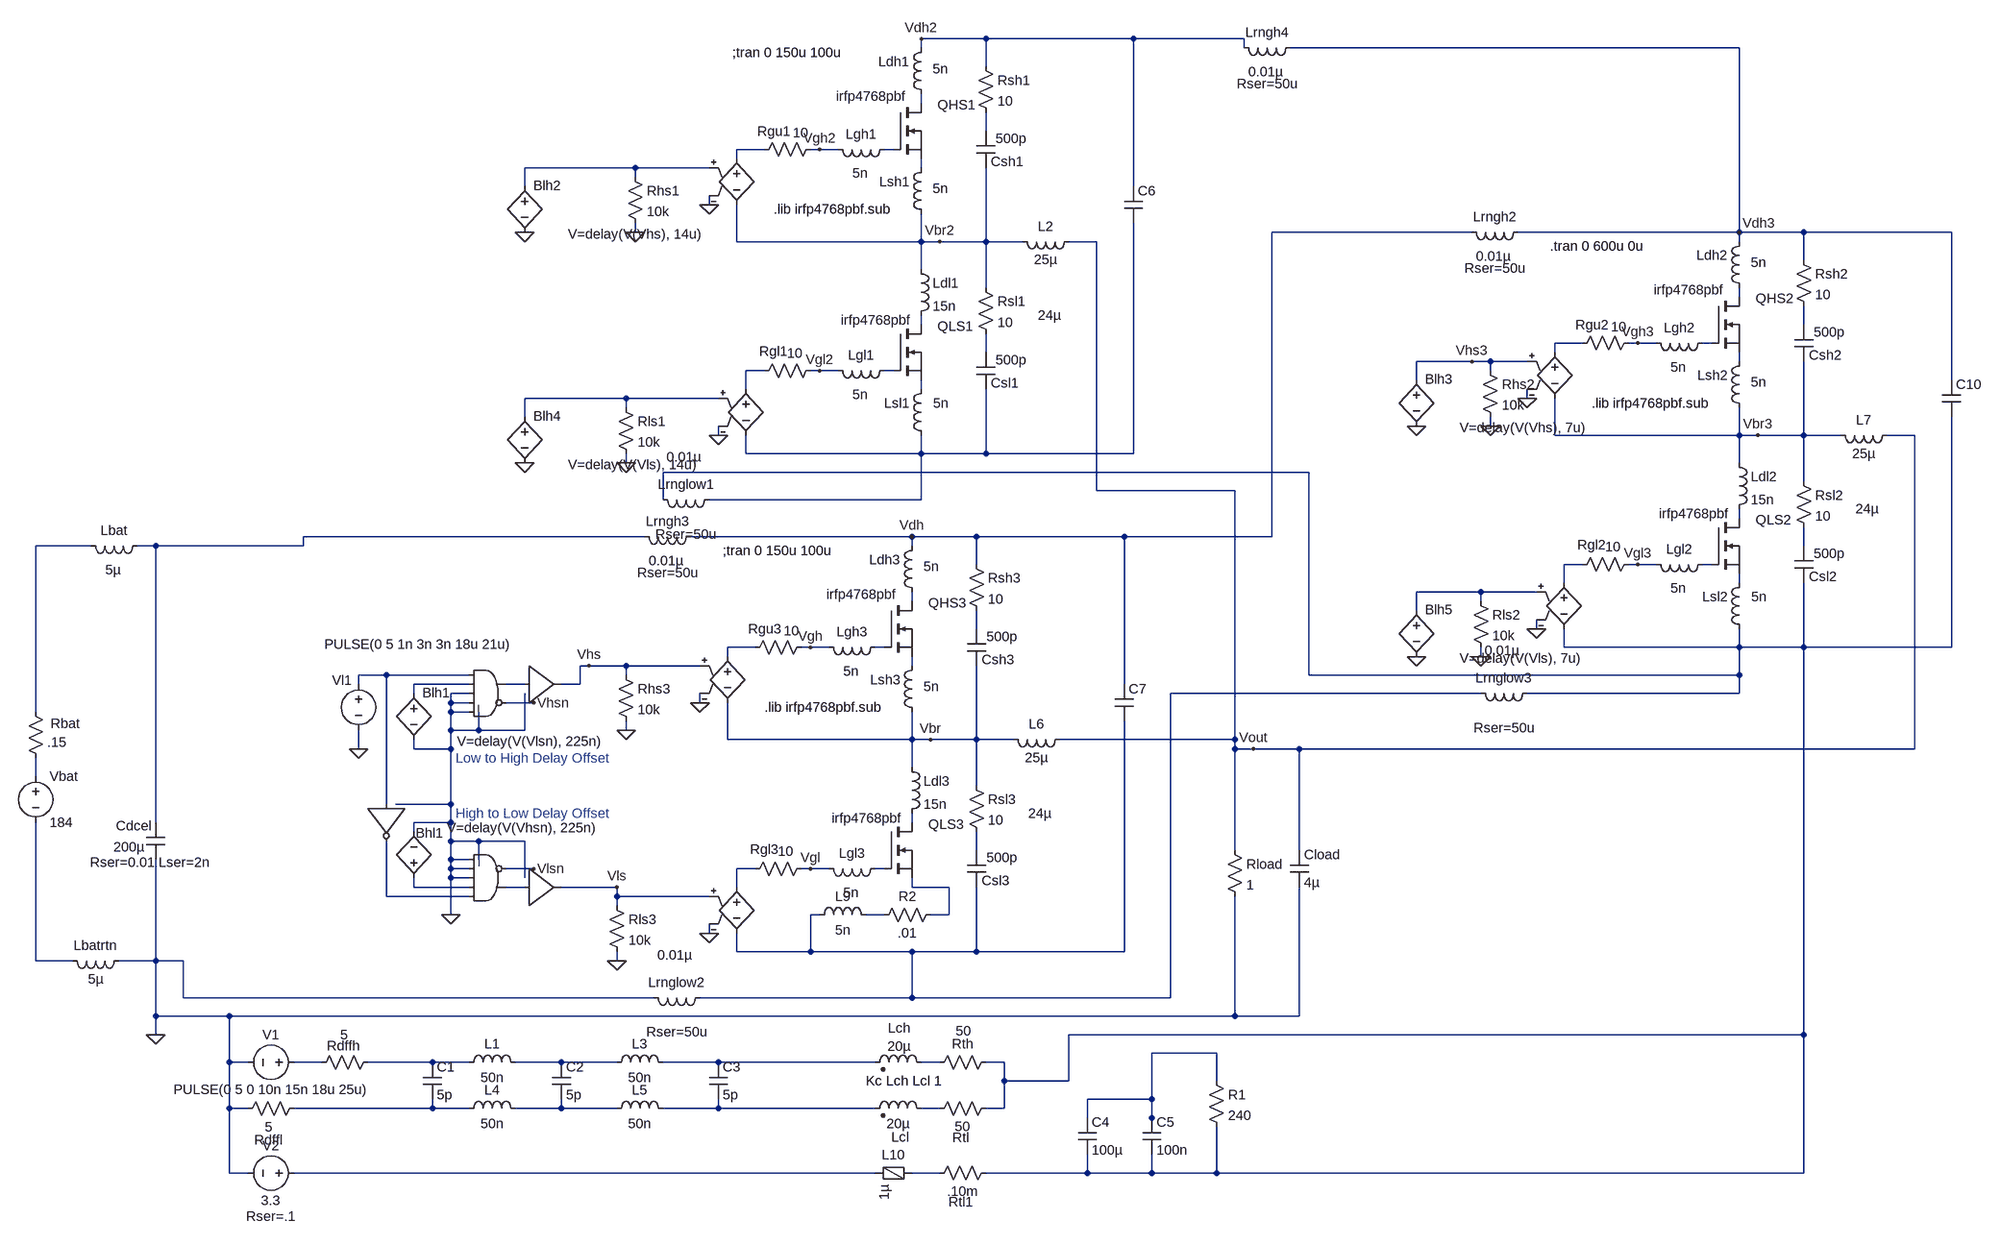
[diagram p0: schematic ETdcdc3P1.asc]
ETdcdc3P1.asc, the LTspice schematic file:
Version 4
SHEET 1 880 1164
WIRE -2224 -896 -2336 -896
WIRE -1968 -896 -2224 -896
WIRE -1776 -896 -1968 -896
WIRE -2336 -880 -2336 -896
WIRE -1776 -880 -1776 -896
WIRE -672 -880 -1696 -880
WIRE -2224 -848 -2224 -896
WIRE -2336 -784 -2336 -800
WIRE -2224 -736 -2224 -768
WIRE -2608 -704 -2656 -704
WIRE -2512 -704 -2528 -704
WIRE -2480 -704 -2512 -704
WIRE -2384 -704 -2400 -704
WIRE -2656 -688 -2656 -704
WIRE -2832 -672 -3024 -672
WIRE -2704 -672 -2832 -672
WIRE -2336 -672 -2336 -688
WIRE -2832 -656 -2832 -672
WIRE -3024 -640 -3024 -672
WIRE -1968 -640 -1968 -896
WIRE -2704 -608 -2704 -624
WIRE -2832 -560 -2832 -576
WIRE -1136 -560 -1728 -560
WIRE -672 -560 -672 -880
WIRE -672 -560 -1056 -560
WIRE -560 -560 -672 -560
WIRE -304 -560 -560 -560
WIRE -2656 -544 -2656 -608
WIRE -2336 -544 -2336 -592
WIRE -2336 -544 -2656 -544
WIRE -2304 -544 -2336 -544
WIRE -2224 -544 -2224 -672
WIRE -2224 -544 -2304 -544
WIRE -2160 -544 -2224 -544
WIRE -2032 -544 -2080 -544
WIRE -672 -544 -672 -560
WIRE -560 -512 -560 -560
WIRE -2336 -496 -2336 -544
WIRE -2224 -464 -2224 -544
WIRE -672 -448 -672 -464
WIRE -2336 -400 -2336 -416
WIRE -560 -400 -560 -432
WIRE -944 -368 -992 -368
WIRE -848 -368 -864 -368
WIRE -816 -368 -848 -368
WIRE -720 -368 -736 -368
WIRE -2224 -352 -2224 -384
WIRE -992 -352 -992 -368
WIRE -1136 -336 -1232 -336
WIRE -1104 -336 -1136 -336
WIRE -1040 -336 -1104 -336
WIRE -672 -336 -672 -352
WIRE -2608 -320 -2640 -320
WIRE -2512 -320 -2528 -320
WIRE -2480 -320 -2512 -320
WIRE -2384 -320 -2400 -320
WIRE -1104 -320 -1104 -336
WIRE -1232 -304 -1232 -336
WIRE -304 -304 -304 -560
WIRE -2640 -288 -2640 -320
WIRE -2336 -288 -2336 -304
WIRE -2848 -272 -3024 -272
WIRE -2688 -272 -2848 -272
WIRE -1040 -272 -1040 -288
WIRE -2848 -256 -2848 -272
WIRE -3024 -240 -3024 -272
WIRE -1104 -224 -1104 -240
WIRE -2688 -208 -2688 -224
WIRE -992 -208 -992 -272
WIRE -672 -208 -672 -256
WIRE -672 -208 -992 -208
WIRE -640 -208 -672 -208
WIRE -560 -208 -560 -336
WIRE -560 -208 -640 -208
WIRE -496 -208 -560 -208
WIRE -368 -208 -416 -208
WIRE -2640 -176 -2640 -208
WIRE -2336 -176 -2336 -208
WIRE -2336 -176 -2640 -176
WIRE -2224 -176 -2224 -288
WIRE -2224 -176 -2336 -176
WIRE -1968 -176 -1968 -576
WIRE -1968 -176 -2224 -176
WIRE -2848 -160 -2848 -176
WIRE -672 -160 -672 -208
WIRE -1664 -144 -2784 -144
WIRE -560 -128 -560 -208
WIRE -2032 -112 -2032 -544
WIRE -1792 -112 -2032 -112
WIRE -2784 -96 -2784 -144
WIRE -2336 -96 -2336 -176
WIRE -2336 -96 -2704 -96
WIRE -672 -64 -672 -80
WIRE -2816 -32 -3408 -32
WIRE -2352 -32 -2736 -32
WIRE -2240 -32 -2352 -32
WIRE -1984 -32 -2240 -32
WIRE -1728 -32 -1728 -560
WIRE -1728 -32 -1984 -32
WIRE -3776 -16 -3872 -16
WIRE -3664 -16 -3696 -16
WIRE -3408 -16 -3408 -32
WIRE -3408 -16 -3664 -16
WIRE -2352 -16 -2352 -32
WIRE -560 -16 -560 -48
WIRE -2240 16 -2240 -32
WIRE -944 16 -976 16
WIRE -848 16 -864 16
WIRE -816 16 -848 16
WIRE -720 16 -736 16
WIRE -976 48 -976 16
WIRE -672 48 -672 32
WIRE -1120 64 -1232 64
WIRE -1024 64 -1120 64
WIRE -2352 80 -2352 64
WIRE -1120 80 -1120 64
WIRE -1232 96 -1232 64
WIRE -2240 128 -2240 96
WIRE -1024 128 -1024 112
WIRE -2624 160 -2672 160
WIRE -2528 160 -2544 160
WIRE -2496 160 -2528 160
WIRE -2400 160 -2416 160
WIRE -976 160 -976 128
WIRE -672 160 -672 128
WIRE -672 160 -976 160
WIRE -560 160 -560 48
WIRE -560 160 -672 160
WIRE -304 160 -304 -240
WIRE -304 160 -560 160
WIRE -2672 176 -2672 160
WIRE -1120 176 -1120 160
WIRE -2912 192 -2928 192
WIRE -2848 192 -2912 192
WIRE -2720 192 -2848 192
WIRE -2352 192 -2352 176
WIRE -3264 208 -3312 208
WIRE -3120 208 -3264 208
WIRE -2848 208 -2848 192
WIRE -1664 208 -1664 -144
WIRE -672 208 -672 160
WIRE -672 208 -1664 208
WIRE -3312 224 -3312 208
WIRE -3120 224 -3216 224
WIRE -3024 224 -3056 224
WIRE -2928 224 -2928 192
WIRE -2928 224 -2960 224
WIRE -1984 224 -1984 -32
WIRE -3216 240 -3216 224
WIRE -3120 240 -3152 240
WIRE -1120 240 -1904 240
WIRE -672 240 -672 208
WIRE -672 240 -1040 240
WIRE -3152 256 -3152 240
WIRE -3120 256 -3152 256
WIRE -3008 256 -3056 256
WIRE -2720 256 -2720 240
WIRE -3872 272 -3872 -16
WIRE -3152 272 -3152 256
WIRE -3120 272 -3152 272
WIRE -3152 304 -3152 272
WIRE -3104 304 -3104 272
WIRE -3104 304 -3152 304
WIRE -3024 304 -3024 240
WIRE -3024 304 -3104 304
WIRE -2848 304 -2848 288
WIRE -2672 320 -2672 256
WIRE -2352 320 -2352 272
WIRE -2352 320 -2672 320
WIRE -2320 320 -2352 320
WIRE -2240 320 -2240 192
WIRE -2240 320 -2320 320
WIRE -2176 320 -2240 320
WIRE -1792 320 -1792 -112
WIRE -1792 320 -2096 320
WIRE -3312 336 -3312 304
WIRE -3216 336 -3216 320
WIRE -3152 336 -3152 304
WIRE -3152 336 -3216 336
WIRE -1792 336 -1792 320
WIRE -1760 336 -1792 336
WIRE -1680 336 -1760 336
WIRE -368 336 -368 -208
WIRE -368 336 -1680 336
WIRE -2352 368 -2352 320
WIRE -3872 384 -3872 352
WIRE -2240 400 -2240 320
WIRE -3264 432 -3264 208
WIRE -3152 432 -3152 336
WIRE -3152 432 -3248 432
WIRE -3664 464 -3664 -16
WIRE -3152 464 -3152 432
WIRE -3152 464 -3216 464
WIRE -2352 464 -2352 448
WIRE -3216 480 -3216 464
WIRE -3152 496 -3152 464
WIRE -3104 496 -3152 496
WIRE -3024 496 -3104 496
WIRE -2240 512 -2240 480
WIRE -1792 512 -1792 336
WIRE -1680 512 -1680 336
WIRE -3152 528 -3152 496
WIRE -3120 528 -3152 528
WIRE -3104 528 -3104 496
WIRE -3152 544 -3152 528
WIRE -3120 544 -3152 544
WIRE -3008 544 -3056 544
WIRE -2624 544 -2656 544
WIRE -2528 544 -2544 544
WIRE -2496 544 -2528 544
WIRE -2400 544 -2416 544
WIRE -3152 560 -3152 544
WIRE -3120 560 -3152 560
WIRE -3024 560 -3024 496
WIRE -3216 576 -3216 560
WIRE -3120 576 -3216 576
WIRE -3024 576 -3056 576
WIRE -2864 576 -2960 576
WIRE -2656 576 -2656 544
WIRE -2352 576 -2352 560
WIRE -2288 576 -2352 576
WIRE -3264 592 -3264 496
WIRE -3120 592 -3264 592
WIRE -2864 592 -2864 576
WIRE -2704 592 -2864 592
WIRE -2864 608 -2864 592
WIRE -3152 624 -3152 560
WIRE -2512 624 -2528 624
WIRE -2400 624 -2432 624
WIRE -2288 624 -2288 576
WIRE -2288 624 -2320 624
WIRE -2704 656 -2704 640
WIRE -2656 688 -2656 656
WIRE -2528 688 -2528 624
WIRE -2528 688 -2656 688
WIRE -2352 688 -2528 688
WIRE -2240 688 -2240 576
WIRE -2240 688 -2352 688
WIRE -1984 688 -1984 288
WIRE -1984 688 -2240 688
WIRE -3872 704 -3872 464
WIRE -3808 704 -3872 704
WIRE -3664 704 -3664 528
WIRE -3664 704 -3728 704
WIRE -3616 704 -3664 704
WIRE -2864 704 -2864 688
WIRE -3616 768 -3616 704
WIRE -2800 768 -3616 768
WIRE -2352 768 -2352 688
WIRE -2352 768 -2720 768
WIRE -1904 768 -1904 240
WIRE -1904 768 -2352 768
WIRE -3664 800 -3664 704
WIRE -3536 800 -3664 800
WIRE -1792 800 -1792 592
WIRE -1792 800 -3536 800
WIRE -1680 800 -1680 576
WIRE -1680 800 -1792 800
WIRE -3664 832 -3664 800
WIRE -560 832 -560 160
WIRE -560 832 -2080 832
WIRE -1824 864 -1936 864
WIRE -3536 880 -3536 800
WIRE -3504 880 -3536 880
WIRE -3376 880 -3424 880
WIRE -3184 880 -3296 880
WIRE -3120 880 -3184 880
WIRE -2960 880 -3040 880
WIRE -2864 880 -2960 880
WIRE -2688 880 -2784 880
WIRE -2416 880 -2688 880
WIRE -2304 880 -2336 880
WIRE -2192 880 -2224 880
WIRE -2192 912 -2192 880
WIRE -2080 912 -2080 832
WIRE -2080 912 -2192 912
WIRE -1824 912 -1824 864
WIRE -1936 944 -1936 864
WIRE -1936 944 -2048 944
WIRE -3536 960 -3536 880
WIRE -3504 960 -3536 960
WIRE -3184 960 -3184 944
WIRE -3184 960 -3424 960
WIRE -3120 960 -3184 960
WIRE -2960 960 -2960 944
WIRE -2960 960 -3040 960
WIRE -2864 960 -2960 960
WIRE -2688 960 -2688 944
WIRE -2688 960 -2784 960
WIRE -2416 960 -2688 960
WIRE -2304 960 -2336 960
WIRE -2192 960 -2192 912
WIRE -2192 960 -2224 960
WIRE -2048 976 -2048 944
WIRE -1936 976 -1936 944
WIRE -1936 992 -1936 976
WIRE -3536 1072 -3536 960
WIRE -3504 1072 -3536 1072
WIRE -2416 1072 -3424 1072
WIRE -2304 1072 -2352 1072
WIRE -2048 1072 -2048 1040
WIRE -2048 1072 -2224 1072
WIRE -1936 1072 -1936 1040
WIRE -1936 1072 -2048 1072
WIRE -1824 1072 -1824 992
WIRE -1824 1072 -1936 1072
WIRE -560 1072 -560 832
WIRE -560 1072 -1824 1072
FLAG -3664 832 0
FLAG -1760 336 Vout
FLAG -1040 -272 0
FLAG -1024 128 0
FLAG -640 -208 Vbr3
FLAG -848 -368 Vgh3
FLAG -848 16 Vgl3
FLAG -672 -560 Vdh3
FLAG -1120 176 0
FLAG -1104 -224 0
FLAG -1136 -336 Vhs3
FLAG -2704 -608 0
FLAG -2688 -208 0
FLAG -2304 -544 Vbr2
FLAG -2512 -704 Vgh2
FLAG -2512 -320 Vgl2
FLAG -2336 -896 Vdh2
FLAG -2848 -160 0
FLAG -2832 -560 0
FLAG -2720 256 0
FLAG -2704 656 0
FLAG -2320 320 Vbr
FLAG -2528 160 Vgh
FLAG -2528 544 Vgl
FLAG -2352 -32 Vdh
FLAG -2864 704 0
FLAG -2848 304 0
FLAG -3152 624 0
FLAG -3312 336 0
FLAG -3008 256 Vhsn
FLAG -3008 544 Vlsn
FLAG -3024 -560 0
FLAG -3024 -160 0
FLAG -2912 192 Vhs
FLAG -2864 576 Vls
FLAG -1232 -224 0
FLAG -1232 176 0
SYMBOL ind -3712 688 R90
WINDOW 0 5 56 VBottom 2
WINDOW 3 32 56 VTop 2
SYMATTR InstName Lbatrtn
SYMATTR Value 5µ
SYMATTR SpiceLine Ipk=0.21 Rser=0 Rpar=0 Cpar=0
SYMBOL voltage -3872 368 R0
WINDOW 123 0 0 Left 2
WINDOW 39 0 0 Left 2
SYMATTR InstName Vbat
SYMATTR Value 184
SYMBOL ind -3792 -32 M90
WINDOW 0 5 56 VBottom 2
WINDOW 3 42 54 VTop 2
SYMATTR InstName Lbat
SYMATTR Value 5µ
SYMBOL res -1808 496 R0
SYMATTR InstName Rload
SYMATTR Value 1
SYMBOL cap -1696 512 R0
SYMATTR InstName Cload
SYMATTR Value 4µ
SYMBOL cap -3680 464 R0
WINDOW 0 -53 6 Left 2
WINDOW 3 -57 42 Left 2
WINDOW 39 -98 69 Left 2
SYMATTR InstName Cdcel
SYMATTR Value 200µ
SYMATTR SpiceLine Rser=0.01 Lser=2n
SYMBOL res -3888 256 R0
WINDOW 0 42 36 Left 2
WINDOW 3 36 69 Left 2
SYMATTR InstName Rbat
SYMATTR Value .15
SYMBOL res -2208 864 R90
WINDOW 0 0 56 VBottom 2
WINDOW 3 -54 55 VTop 2
SYMATTR InstName Rth
SYMATTR Value 50
SYMBOL res -2320 976 R270
WINDOW 0 -50 53 VTop 2
WINDOW 3 0 56 VBottom 2
SYMATTR InstName Rtl
SYMATTR Value 50
SYMBOL res -3280 864 R90
WINDOW 0 3 58 VBottom 2
WINDOW 3 -47 57 VTop 2
SYMATTR InstName Rdffh
SYMATTR Value 5
SYMBOL res -3408 944 R90
WINDOW 0 86 60 VBottom 2
WINDOW 3 33 60 VTop 2
SYMATTR InstName Rdffl
SYMATTR Value 5
SYMBOL ind2 -2320 896 M270
WINDOW 0 60 54 VTop 2
WINDOW 3 59 54 VBottom 2
SYMATTR InstName Lch
SYMATTR Value 20µ
SYMATTR SpiceLine Rser=1m Cpar=15p
SYMATTR Type ind
SYMBOL ind2 -2320 976 M270
WINDOW 0 -49 52 VTop 2
WINDOW 3 5 56 VBottom 2
SYMATTR InstName Lcl
SYMATTR Value 20µ
SYMATTR SpiceLine Rser=1m Cpar=15p
SYMATTR Type ind
SYMBOL voltage -3408 880 R90
WINDOW 0 -32 56 VBottom 2
WINDOW 3 32 56 VTop 2
WINDOW 123 0 0 Left 2
WINDOW 39 0 0 Left 2
SYMATTR InstName V1
SYMATTR Value PULSE(0 5 0 10n 15n 18u 25u)
SYMBOL ind -3136 896 R270
WINDOW 0 32 56 VTop 2
WINDOW 3 5 56 VBottom 2
SYMATTR InstName L1
SYMATTR Value 50n
SYMBOL ind -2880 896 R270
WINDOW 0 32 56 VTop 2
WINDOW 3 5 56 VBottom 2
SYMATTR InstName L3
SYMATTR Value 50n
SYMBOL ind -3136 976 R270
WINDOW 0 32 56 VTop 2
WINDOW 3 5 56 VBottom 2
SYMATTR InstName L4
SYMATTR Value 50n
SYMBOL ind -2880 976 R270
WINDOW 0 32 56 VTop 2
WINDOW 3 5 56 VBottom 2
SYMATTR InstName L5
SYMATTR Value 50n
SYMBOL cap -3200 880 R0
SYMATTR InstName C1
SYMATTR Value 5p
SYMBOL cap -2976 880 R0
SYMATTR InstName C2
SYMATTR Value 5p
SYMBOL cap -2704 880 R0
SYMATTR InstName C3
SYMATTR Value 5p
SYMBOL res -2320 1088 R270
WINDOW 0 -50 53 VTop 2
WINDOW 3 0 56 VBottom 2
SYMATTR InstName Rtl1
SYMATTR Value .10m
SYMBOL cap -2064 976 R0
SYMATTR InstName C4
SYMATTR Value 100µ
SYMATTR SpiceLine V=50 Rser=.2 Lser=5n
SYMBOL voltage -3408 1072 R90
WINDOW 0 -32 56 VBottom 2
WINDOW 3 32 56 VTop 2
WINDOW 123 0 0 Left 2
WINDOW 39 60 56 VTop 2
SYMATTR InstName V2
SYMATTR Value 3.3
SYMATTR SpiceLine Rser=.1
SYMBOL cap -1952 976 R0
SYMATTR InstName C5
SYMATTR Value 100n
SYMATTR SpiceLine Rser=1m Lser=.1n
SYMBOL res -1840 896 R0
SYMATTR InstName R1
SYMATTR Value 240
SYMBOL ind -688 -176 R0
SYMATTR InstName Ldl2
SYMATTR Value 15n
SYMBOL ind -656 -352 M0
WINDOW 3 -31 52 Left 2
SYMATTR Value 5n
SYMATTR InstName Lsh2
SYMATTR SpiceLine Rser=1m
SYMBOL res -960 -352 R270
WINDOW 0 32 33 VTop 2
WINDOW 3 60 79 VBottom 2
SYMATTR InstName Rgu2
SYMATTR Value 10
SYMBOL ind -656 32 M0
WINDOW 3 -32 40 Left 2
SYMATTR Value 5n
SYMATTR InstName Lsl2
SYMBOL res -960 32 R270
WINDOW 0 34 32 VTop 2
WINDOW 3 62 69 VBottom 2
SYMATTR InstName Rgl2
SYMATTR Value 10
SYMBOL nmos -720 -64 R0
WINDOW 0 76 3 Left 2
WINDOW 3 -91 -8 Left 2
SYMATTR InstName QLS2
SYMATTR Value irfp4768pbf
SYMATTR Prefix X
SYMBOL ind -512 -224 M90
WINDOW 0 5 56 VBottom 2
WINDOW 3 32 56 VTop 2
SYMATTR InstName L7
SYMATTR Value 25µ
SYMATTR SpiceLine Cpar=15p
SYMBOL e -992 -368 R0
WINDOW 0 24 16 Invisible 2
WINDOW 3 24 96 Invisible 2
SYMATTR InstName E5
SYMATTR Value 1
SYMBOL e -976 32 R0
WINDOW 0 24 16 Invisible 2
WINDOW 3 24 96 Invisible 2
SYMATTR InstName E6
SYMATTR Value 1
SYMBOL nmos -720 -448 R0
WINDOW 0 76 3 Left 2
WINDOW 3 -100 -12 Left 2
SYMATTR InstName QHS2
SYMATTR Value irfp4768pbf
SYMATTR Prefix X
SYMBOL ind -656 -560 M0
WINDOW 3 -31 52 Left 2
SYMATTR Value 5n
SYMATTR InstName Ldh2
SYMATTR SpiceLine Rser=1m
SYMBOL ind -832 -384 M90
WINDOW 0 5 56 VBottom 2
WINDOW 3 42 54 VTop 2
WINDOW 39 94 56 VBottom 2
SYMATTR InstName Lgh2
SYMATTR Value 5n
SYMBOL ind -832 0 M90
WINDOW 0 5 56 VBottom 2
WINDOW 3 42 54 VTop 2
WINDOW 39 94 56 VBottom 2
SYMATTR InstName Lgl2
SYMATTR Value 5n
SYMBOL res -576 -528 R0
SYMATTR InstName Rsh2
SYMATTR Value 10
SYMBOL cap -576 -400 R0
WINDOW 0 25 53 Left 2
WINDOW 3 33 13 Left 2
SYMATTR InstName Csh2
SYMATTR Value 500p
SYMBOL res -576 -144 R0
SYMATTR InstName Rsl2
SYMATTR Value 10
SYMBOL cap -576 -16 R0
WINDOW 0 25 53 Left 2
WINDOW 3 33 13 Left 2
SYMATTR InstName Csl2
SYMATTR Value 500p
SYMBOL res -1136 64 R0
SYMATTR InstName Rls2
SYMATTR Value 10k
SYMBOL res -1120 -336 R0
SYMATTR InstName Rhs2
SYMATTR Value 10k
SYMBOL ind -1152 -576 M90
WINDOW 0 5 56 VBottom 2
WINDOW 3 42 54 VTop 2
WINDOW 39 94 56 VBottom 2
SYMATTR InstName Lrngh2
SYMATTR Value 0.01µ
SYMATTR SpiceLine Rser=50u
SYMBOL cap -320 -304 R0
WINDOW 3 -150 224 Left 2
SYMATTR Value 24µ
SYMATTR InstName C10
SYMATTR SpiceLine Rser=5m Lser=5p
SYMBOL ind -1024 224 R90
WINDOW 0 5 56 VBottom 2
WINDOW 3 -74 59 VTop 2
WINDOW 39 60 56 VTop 2
SYMATTR InstName Lrnglow3
SYMATTR Value 0.01µ
SYMATTR SpiceLine Rser=50u
SYMBOL ind -2352 -512 R0
SYMATTR InstName Ldl1
SYMATTR Value 15n
SYMBOL ind -2320 -688 M0
WINDOW 3 -31 52 Left 2
SYMATTR Value 5n
SYMATTR InstName Lsh1
SYMATTR SpiceLine Rser=1m
SYMBOL res -2624 -688 R270
WINDOW 0 32 33 VTop 2
WINDOW 3 60 79 VBottom 2
SYMATTR InstName Rgu1
SYMATTR Value 10
SYMBOL ind -2320 -304 M0
WINDOW 3 -32 40 Left 2
SYMATTR Value 5n
SYMATTR InstName Lsl1
SYMBOL res -2624 -304 R270
WINDOW 0 34 32 VTop 2
WINDOW 3 62 69 VBottom 2
SYMATTR InstName Rgl1
SYMATTR Value 10
SYMBOL nmos -2384 -400 R0
WINDOW 0 76 3 Left 2
WINDOW 3 -91 -8 Left 2
SYMATTR InstName QLS1
SYMATTR Value irfp4768pbf
SYMATTR Prefix X
SYMBOL ind -2176 -560 M90
WINDOW 0 5 56 VBottom 2
WINDOW 3 32 56 VTop 2
SYMATTR InstName L2
SYMATTR Value 25µ
SYMATTR SpiceLine Cpar=15p
SYMBOL e -2656 -704 R0
WINDOW 0 24 16 Invisible 2
WINDOW 3 24 96 Invisible 2
SYMATTR InstName E1
SYMATTR Value 1
SYMBOL e -2640 -304 R0
WINDOW 0 24 16 Invisible 2
WINDOW 3 24 96 Invisible 2
SYMATTR InstName E2
SYMATTR Value 1
SYMBOL nmos -2384 -784 R0
WINDOW 0 76 3 Left 2
WINDOW 3 -100 -12 Left 2
SYMATTR InstName QHS1
SYMATTR Value irfp4768pbf
SYMATTR Prefix X
SYMBOL ind -2320 -896 M0
WINDOW 3 -31 52 Left 2
SYMATTR Value 5n
SYMATTR InstName Ldh1
SYMATTR SpiceLine Rser=1m
SYMBOL ind -2496 -720 M90
WINDOW 0 5 56 VBottom 2
WINDOW 3 42 54 VTop 2
WINDOW 39 94 56 VBottom 2
SYMATTR InstName Lgh1
SYMATTR Value 5n
SYMBOL ind -2496 -336 M90
WINDOW 0 5 56 VBottom 2
WINDOW 3 42 54 VTop 2
WINDOW 39 94 56 VBottom 2
SYMATTR InstName Lgl1
SYMATTR Value 5n
SYMBOL res -2240 -864 R0
SYMATTR InstName Rsh1
SYMATTR Value 10
SYMBOL cap -2240 -736 R0
WINDOW 0 25 53 Left 2
WINDOW 3 33 13 Left 2
SYMATTR InstName Csh1
SYMATTR Value 500p
SYMBOL res -2240 -480 R0
SYMATTR InstName Rsl1
SYMATTR Value 10
SYMBOL cap -2240 -352 R0
WINDOW 0 25 53 Left 2
WINDOW 3 33 13 Left 2
SYMATTR InstName Csl1
SYMATTR Value 500p
SYMBOL res -2864 -272 R0
SYMATTR InstName Rls1
SYMATTR Value 10k
SYMBOL res -2848 -672 R0
SYMATTR InstName Rhs1
SYMATTR Value 10k
SYMBOL cap -1984 -640 R0
WINDOW 3 -150 224 Left 2
SYMATTR Value 24µ
SYMATTR InstName C6
SYMATTR SpiceLine Rser=5m Lser=5p
SYMBOL ind -2688 -112 R90
WINDOW 0 5 56 VBottom 2
WINDOW 3 -74 59 VTop 2
WINDOW 39 60 56 VTop 2
SYMATTR InstName Lrnglow1
SYMATTR Value 0.01µ
SYMATTR SpiceLine Rser=50u
SYMBOL ind -2368 352 R0
SYMATTR InstName Ldl3
SYMATTR Value 15n
SYMBOL ind -2336 176 M0
WINDOW 3 -31 52 Left 2
SYMATTR Value 5n
SYMATTR InstName Lsh3
SYMATTR SpiceLine Rser=1m
SYMBOL res -2640 176 R270
WINDOW 0 32 33 VTop 2
WINDOW 3 60 79 VBottom 2
SYMATTR InstName Rgu3
SYMATTR Value 10
SYMBOL res -2640 560 R270
WINDOW 0 34 32 VTop 2
WINDOW 3 62 69 VBottom 2
SYMATTR InstName Rgl3
SYMATTR Value 10
SYMBOL nmos -2400 464 R0
WINDOW 0 76 3 Left 2
WINDOW 3 -91 -8 Left 2
SYMATTR InstName QLS3
SYMATTR Value irfp4768pbf
SYMATTR Prefix X
SYMBOL ind -2192 304 M90
WINDOW 0 5 56 VBottom 2
WINDOW 3 32 56 VTop 2
SYMATTR InstName L6
SYMATTR Value 25µ
SYMATTR SpiceLine Cpar=15p
SYMBOL e -2672 160 R0
WINDOW 0 24 16 Invisible 2
WINDOW 3 24 96 Invisible 2
SYMATTR InstName E3
SYMATTR Value 1
SYMBOL e -2656 560 R0
WINDOW 0 24 16 Invisible 2
WINDOW 3 24 96 Invisible 2
SYMATTR InstName E4
SYMATTR Value 1
SYMBOL nmos -2400 80 R0
WINDOW 0 76 3 Left 2
WINDOW 3 -100 -12 Left 2
SYMATTR InstName QHS3
SYMATTR Value irfp4768pbf
SYMATTR Prefix X
SYMBOL ind -2336 -32 M0
WINDOW 3 -31 52 Left 2
SYMATTR Value 5n
SYMATTR InstName Ldh3
SYMATTR SpiceLine Rser=1m
SYMBOL ind -2512 144 M90
WINDOW 0 5 56 VBottom 2
WINDOW 3 42 54 VTop 2
WINDOW 39 94 56 VBottom 2
SYMATTR InstName Lgh3
SYMATTR Value 5n
SYMBOL ind -2512 528 M90
WINDOW 0 5 56 VBottom 2
WINDOW 3 42 54 VTop 2
WINDOW 39 94 56 VBottom 2
SYMATTR InstName Lgl3
SYMATTR Value 5n
SYMBOL res -2256 0 R0
SYMATTR InstName Rsh3
SYMATTR Value 10
SYMBOL cap -2256 128 R0
WINDOW 0 25 53 Left 2
WINDOW 3 33 13 Left 2
SYMATTR InstName Csh3
SYMATTR Value 500p
SYMBOL res -2256 384 R0
SYMATTR InstName Rsl3
SYMATTR Value 10
SYMBOL cap -2256 512 R0
WINDOW 0 25 53 Left 2
WINDOW 3 33 13 Left 2
SYMATTR InstName Csl3
SYMATTR Value 500p
SYMBOL res -2880 592 R0
SYMATTR InstName Rls3
SYMATTR Value 10k
SYMBOL res -2864 192 R0
SYMATTR InstName Rhs3
SYMATTR Value 10k
SYMBOL ind -2832 -48 M90
WINDOW 0 5 56 VBottom 2
WINDOW 3 42 54 VTop 2
WINDOW 39 94 56 VBottom 2
SYMATTR InstName Lrngh3
SYMATTR Value 0.01µ
SYMATTR SpiceLine Rser=50u
SYMBOL cap -2000 224 R0
WINDOW 3 -150 224 Left 2
SYMATTR Value 24µ
SYMATTR InstName C7
SYMATTR SpiceLine Rser=5m Lser=5p
SYMBOL ind -2704 752 R90
WINDOW 0 5 56 VBottom 2
WINDOW 3 -74 59 VTop 2
WINDOW 39 60 56 VTop 2
SYMATTR InstName Lrnglow2
SYMATTR Value 0.01µ
SYMATTR SpiceLine Rser=50u
SYMBOL ind -1792 -896 M90
WINDOW 0 5 56 VBottom 2
WINDOW 3 42 54 VTop 2
WINDOW 39 94 56 VBottom 2
SYMATTR InstName Lrngh4
SYMATTR Value 0.01µ
SYMATTR SpiceLine Rser=50u
SYMBOL voltage -3312 208 R0
WINDOW 3 -59 -53 Left 2
WINDOW 123 0 0 Left 2
WINDOW 39 0 0 Left 2
WINDOW 0 -46 9 Left 2
SYMATTR Value PULSE(0 5 1n 3n 3n 18u 21u)
SYMATTR InstName Vl1
SYMBOL Digital\\and -3088 176 R0
WINDOW 0 16 24 Invisible 2
SYMATTR InstName A1
SYMATTR SpiceLine Vhigh=5 Rhigh=50 Rlow=50 Rout=50
SYMBOL Digital\\and -3088 624 M180
WINDOW 0 16 24 Invisible 2
SYMATTR InstName A2
SYMATTR SpiceLine Vhigh=5 Rhigh=50 Rlow=50 Rout=50
SYMBOL Digital\\inv -3328 432 M90
WINDOW 0 8 32 Invisible 2
SYMATTR InstName A3
SYMATTR SpiceLine Vhigh=5
SYMBOL Digital\\buf1 -3024 160 R0
WINDOW 0 8 32 Invisible 2
SYMATTR InstName A19
SYMATTR SpiceLine Vhigh=12 Trise=60n Tfall=40n Ref=0.2
SYMBOL Digital\\buf1 -3024 640 M180
WINDOW 0 8 32 Invisible 2
SYMATTR InstName A20
SYMATTR SpiceLine Vhigh=12 Trise=60n Tfall=40n Ref=0.2
SYMBOL bv -3216 224 R0
WINDOW 0 15 15 Left 2
WINDOW 3 75 99 Left 2
SYMATTR InstName Blh1
SYMATTR Value V=delay(V(Vlsn), 225n)
SYMBOL bv -3216 576 R180
WINDOW 0 -51 94 Left 2
WINDOW 3 -316 103 Left 2
SYMATTR InstName Bhl1
SYMATTR Value V=delay(V(Vhsn), 225n)
SYMBOL bv -3024 -656 R0
WINDOW 0 15 15 Left 2
WINDOW 3 75 99 Left 2
SYMATTR InstName Blh2
SYMATTR Value V=delay(V(Vhs), 14u)
SYMBOL bv -3024 -256 R0
WINDOW 0 15 15 Left 2
WINDOW 3 75 99 Left 2
SYMATTR InstName Blh4
SYMATTR Value V=delay(V(Vls), 14u)
SYMBOL bv -1232 -320 R0
WINDOW 0 15 15 Left 2
WINDOW 3 75 99 Left 2
SYMATTR InstName Blh3
SYMATTR Value V=delay(V(Vhs), 7u)
SYMBOL bv -1232 80 R0
WINDOW 0 15 15 Left 2
WINDOW 3 75 99 Left 2
SYMATTR InstName Blh5
SYMATTR Value V=delay(V(Vls), 7u)
SYMBOL ind -2528 640 R270
WINDOW 0 32 56 VTop 2
WINDOW 3 5 56 VBottom 2
SYMATTR InstName L9
SYMATTR Value 5n
SYMBOL res -2304 608 R90
WINDOW 0 0 56 VBottom 2
WINDOW 3 32 56 VTop 2
SYMATTR InstName R2
SYMATTR Value .01
SYMBOL FerriteBead -2384 1072 R90
WINDOW 0 -16 0 VBottom 2
SYMATTR InstName L10
SYMATTR Value 1µ
SYMATTR SpiceLine Rser=1m
TEXT -2432 912 Left 2 !Kc Lch Lcl 1
TEXT -1000 -536 Left 2 !.tran 0 600u 0u
TEXT -928 -264 Left 2 !.lib irfp4768pbf.sub
TEXT -2664 -872 Left 2 !;tran 0 150u 100u
TEXT -2592 -600 Left 2 !.lib irfp4768pbf.sub
TEXT -2680 -8 Left 2 !;tran 0 150u 100u
TEXT -2608 264 Left 2 !.lib irfp4768pbf.sub
TEXT -3144 448 Left 2 ;High to Low Delay Offset
TEXT -3144 352 Left 2 ;Low to High Delay Offset

The netlist it stands for:
* ETdcdc3P1.asc
Lbatrtn 0 N047 5µ Ipk=0.21 Rser=0 Rpar=0 Cpar=0
Vbat N037 N047 184
Lbat N022 N021 5µ
Rload Vout 0 1
Cload Vout 0 4µ
Cdcel N021 0 200µ Rser=0.01 Lser=2n
Rbat N022 N037 .15
Rth N019 N053 50
Rtl N057 N019 50
Rdffh N050 N049 5
Rdffl N054 0 5
Lch N053 N052 20µ Rser=1m Cpar=15p
Lcl N057 N056 20µ Rser=1m Cpar=15p
V1 N049 0 PULSE(0 5 0 10n 15n 18u 25u)
L1 N050 N051 50n
L3 N051 N052 50n
L4 N054 N055 50n
L5 N055 N056 50n
C1 N050 N054 5p
C2 N051 N055 5p
C3 N052 N056 5p
Rtl1 N059 N019 .10m
C4 N048 N019 100µ V=50 Rser=.2 Lser=5n
V2 N058 0 3.3 Rser=.1
C5 N048 N019 100n Rser=1m Lser=.1n
R1 N048 N019 240
Ldl2 Vbr3 N020 15n
Lsh2 N013 Vbr3 5n Rser=1m
Rgu2 N010 Vgh3 10
Lsl2 N026 N019 5n
Rgl2 N024 Vgl3 10
XQLS2 N020 N025 N026 irfp4768pbf  ; pins D G S
L7 Vbr3 Vout 25µ Cpar=15p
E5 N010 Vbr3 Vhs3 0 1
E6 N024 N019 N027 0 1
XQHS2 N007 N011 N013 irfp4768pbf  ; pins D G S
Ldh2 Vdh3 N007 5n Rser=1m
Lgh2 Vgh3 N011 5n
Lgl2 Vgl3 N025 5n
Rsh2 Vdh3 N009 10
Csh2 N009 Vbr3 500p
Rsl2 Vbr3 N023 10
Csl2 N023 N019 500p
Rls2 N027 0 10k
Rhs2 Vhs3 0 10k
Lrngh2 Vdh Vdh3 0.01µ Rser=50u
C10 Vdh3 N019 24µ Rser=5m Lser=5p
Lrnglow3 N019 N036 0.01µ Rser=50u
Ldl1 Vbr2 N008 15n
Lsh1 N006 Vbr2 5n Rser=1m
Rgu1 N003 Vgh2 10
Lsl1 N016 N018 5n
Rgl1 N014 Vgl2 10
XQLS1 N008 N015 N016 irfp4768pbf  ; pins D G S
L2 Vbr2 Vout 25µ Cpar=15p
E1 N003 Vbr2 N005 0 1
E2 N014 N018 N017 0 1
XQHS1 N001 N004 N006 irfp4768pbf  ; pins D G S
Ldh1 Vdh2 N001 5n Rser=1m
Lgh1 Vgh2 N004 5n
Lgl1 Vgl2 N015 5n
Rsh1 Vdh2 N002 10
Csh1 N002 Vbr2 500p
Rsl1 Vbr2 N012 10
Csl1 N012 N018 500p
Rls1 N017 0 10k
Rhs1 N005 0 10k
C6 Vdh2 N018 24µ Rser=5m Lser=5p
Lrnglow1 N018 N019 0.01µ Rser=50u
Ldl3 Vbr N038 15n
Lsh3 N032 Vbr 5n Rser=1m
Rgu3 N030 Vgh 10
Rgl3 N040 Vgl 10
XQLS3 N038 N041 N044 irfp4768pbf  ; pins D G S
L6 Vbr Vout 25µ Cpar=15p
E3 N030 Vbr Vhs 0 1
E4 N040 N036 Vls 0 1
XQHS3 N028 N031 N032 irfp4768pbf  ; pins D G S
Ldh3 Vdh N028 5n Rser=1m
Lgh3 Vgh N031 5n
Lgl3 Vgl N041 5n
Rsh3 Vdh N029 10
Csh3 N029 Vbr 500p
Rsl3 Vbr N039 10
Csl3 N039 N036 500p
Rls3 Vls 0 10k
Rhs3 Vhs 0 10k
Lrngh3 N021 Vdh 0.01µ Rser=50u
C7 Vdh N036 24µ Rser=5m Lser=5p
Lrnglow2 N036 0 0.01µ Rser=50u
Lrngh4 Vdh2 Vdh3 0.01µ Rser=50u
Vl1 N033 0 PULSE(0 5 1n 3n 3n 18u 21u)
A1 N033 N034 0 0 0 Vhsn N035 0 AND Vhigh=5 Rhigh=50 Rlow=50 Rout=50
A2 N045 N042 0 0 0 Vlsn N043 0 AND Vhigh=5 Rhigh=50 Rlow=50 Rout=50
A3 N033 0 0 0 0 N045 0 0 BUF Vhigh=5
A19 N035 0 0 0 0 0 Vhs 0 BUF Vhigh=12 Trise=60n Tfall=40n Ref=0.2
A20 N043 0 0 0 0 0 Vls 0 BUF Vhigh=12 Trise=60n Tfall=40n Ref=0.2
Blh1 N034 0 V=delay(V(Vlsn), 225n)
Bhl1 N042 0 V=delay(V(Vhsn), 225n)
Blh2 N005 0 V=delay(V(Vhs), 14u)
Blh4 N017 0 V=delay(V(Vls), 14u)
Blh3 Vhs3 0 V=delay(V(Vhs), 7u)
Blh5 N027 0 V=delay(V(Vls), 7u)
L9 N036 N046 5n
R2 N044 N046 .01
L10 N059 N058 1µ Rser=1m
Kc Lch Lcl 1
.tran 0 600u 0u
.lib irfp4768pbf.sub
;tran 0 150u 100u
.lib irfp4768pbf.sub
;tran 0 150u 100u
.lib irfp4768pbf.sub
* High to Low Delay Offset
* Low to High Delay Offset
.backanno
.end